# EAGLE design board (EAGLE 9.4.2)
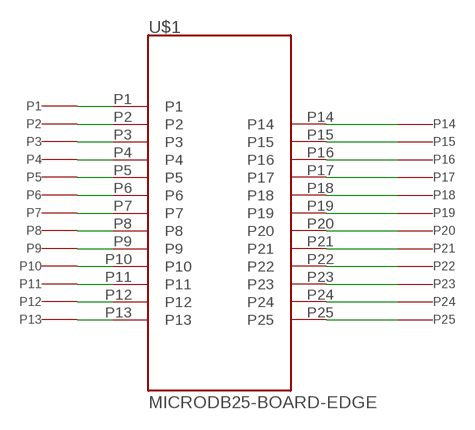
[diagram p0: schematic, sheet 1]

## Parts
P1  TP-19MIL  [TP-19MIL]
P2  TP-19MIL  [TP-19MIL]
P3  TP-19MIL  [TP-19MIL]
P4  TP-19MIL  [TP-19MIL]
P5  TP-19MIL  [TP-19MIL]
P6  TP-19MIL  [TP-19MIL]
P7  TP-19MIL  [TP-19MIL]
P8  TP-19MIL  [TP-19MIL]
P9  TP-19MIL  [TP-19MIL]
P10  TP-19MIL  [TP-19MIL]
P11  TP-19MIL  [TP-19MIL]
P12  TP-19MIL  [TP-19MIL]
P13  TP-19MIL  [TP-19MIL]
P14  TP-19MIL  [TP-19MIL]
P15  TP-19MIL  [TP-19MIL]
P16  TP-19MIL  [TP-19MIL]
P17  TP-19MIL  [TP-19MIL]
P18  TP-19MIL  [TP-19MIL]
P19  TP-19MIL  [TP-19MIL]
P20  TP-19MIL  [TP-19MIL]
P21  TP-19MIL  [TP-19MIL]
P22  TP-19MIL  [TP-19MIL]
P23  TP-19MIL  [TP-19MIL]
P24  TP-19MIL  [TP-19MIL]
P25  TP-19MIL  [TP-19MIL]
U$1  MICRODB25-BOARD-EDGE  [MICRODB25-BOARD-EDGE]

## Nets
N$1: P1.P1 U$1.P1
N$2: P2.P1 U$1.P2
N$3: P3.P1 U$1.P3
N$4: P4.P1 U$1.P4
N$5: P5.P1 U$1.P5
N$6: P6.P1 U$1.P6
N$7: P7.P1 U$1.P7
N$8: P8.P1 U$1.P8
N$9: P9.P1 U$1.P9
N$10: P10.P1 U$1.P10
N$11: P11.P1 U$1.P11
N$12: P12.P1 U$1.P12
N$13: P13.P1 U$1.P13
N$14: P14.P1 U$1.P14
N$15: P15.P1 U$1.P15
N$16: P16.P1 U$1.P16
N$17: P17.P1 U$1.P17
N$18: P18.P1 U$1.P18
N$19: P19.P1 U$1.P19
N$20: P20.P1 U$1.P20
N$21: P21.P1 U$1.P21
N$22: P22.P1 U$1.P22
N$23: P23.P1 U$1.P23
N$24: P24.P1 U$1.P24
N$25: P25.P1 U$1.P25

## Library data of the parts
P1-P25 = RPi-Parts:TP-19MIL
U$1 = RPi-Parts:MICRODB25-BOARD-EDGE

## Board
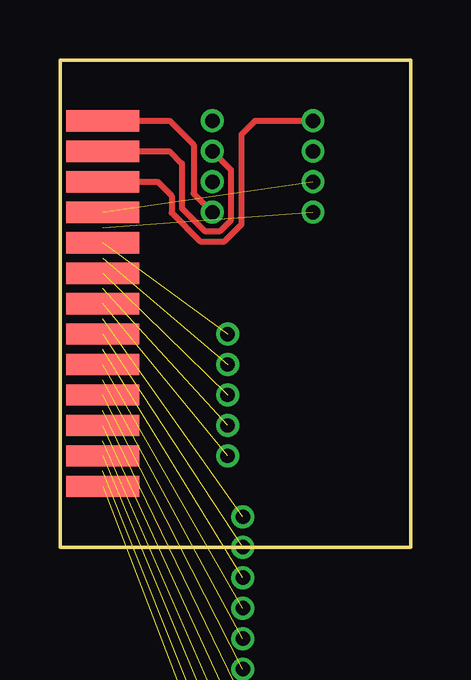
[diagram p1: board, top side]
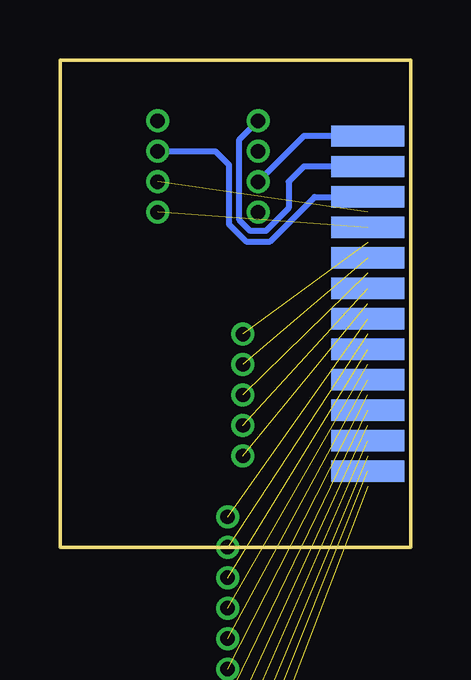
[diagram p2: board, bottom side, seen from below]

Size 14.61 x 20.32 mm. Coordinates in mm from the lower left corner, seen from the top.
Outline: 0,0 0,20.32 14.61,20.32 14.61,0 0,0
Copper layers (1*16): Top 0.035mm / dielectric 1.5mm / Bottom 0.035mm
Design rules "SparkFun-2-layer-TIGHT": minimum track width 7mil, minimum drill 15mil, track to track 7mil, track to pad 7mil, pad to pad 7mil, via to via 7mil, smd to smd 7mil, copper to edge 7mil, drill to drill 7mil, minimum pad ring 7mil, minimum via ring 7mil, stop-mask expansion 4mil, vias tented up to drill 25mil, thermal gap 10mil

### Footprints (pad centres in the part's own frame; a part is rotated, then mirrored left to right if it is on the bottom)
TP-19MIL = drill 0.6 pad 0.838: P1 0,0
MICRODB25-BOARD-EDGE = smd 3.048 x 0.889: P1 0,7.62; P2 0,6.35; P3 0,5.08; P4 0,3.81; P5 0,2.54; P6 0,1.27; P7 0,0; P8 0,-1.27; P9 0,-2.54; P10 0,-3.81; P11 0,-5.08; P12 0,-6.35; P13 0,-7.62 | smd 3.048 x 0.889 bottom: P14 0,6.985; P15 0,5.715; P16 0,4.445; P17 0,3.175; P18 0,1.905; P19 0,0.635; P20 0,-0.635; P21 0,-1.905; P22 0,-3.175; P23 0,-4.445; P24 0,-5.715; P25 0,-6.985

### Placement (x,y rotation side)
P1  6.35,13.97 90 top
P2  6.35,16.51 0 top
P3  10.54,17.78 0 top
P4  10.54,15.24 0 top
P5  6.99,8.89 0 top
P6  6.99,6.35 0 top
P7  6.99,3.81 0 top
P8  7.62,0 180 top
P9  7.62,-2.54 0 top
P10  7.62,-5.08 0 top  (outside the outline)
P11  7.62,-7.62 0 top  (outside the outline)
P12  7.62,-10.16 0 top  (outside the outline)
P13  7.62,-12.7 0 top  (outside the outline)
P14  6.35,15.24 0 top
P15  6.35,17.78 0 top
P16  10.54,16.51 0 top
P17  10.54,13.97 0 top
P18  6.99,7.62 0 top
P19  6.99,5.08 0 top
P20  7.62,1.27 180 top
P21  7.62,-1.27 0 top
P22  7.62,-3.81 0 top  (outside the outline)
P23  7.62,-6.35 0 top  (outside the outline)
P24  7.62,-8.89 0 top  (outside the outline)
P25  7.62,-11.43 0 top  (outside the outline)
U$1  1.78,10.16 0 top

### Tracks (layer width: path | path; a pad name or v marks a point on that pad's centre or on a via)
N$1
  Top 0.254: U$1.P1 4.57,17.78 5.57,16.79 5.57,14.75 P1.P1
N$2
  Top 0.254: U$1.P2 4.57,16.51 5.08,16 5.08,14.13 6.03,13.19 6.67,13.19 7.13,13.65 7.13,15.73 P2.P1
N$3
  Top 0.254: U$1.P3 4.06,15.24 4.65,14.66 4.65,13.95 5.85,12.76 6.85,12.76 7.56,13.47 7.56,17.22 8.13,17.78 P3.P1
N$4  (1 unrouted)
N$5  (1 unrouted)
N$6  (1 unrouted)
N$7  (1 unrouted)
N$8  (1 unrouted)
N$9  (1 unrouted)
N$10  (1 unrouted)
N$11  (1 unrouted)
N$12  (1 unrouted)
N$13  (1 unrouted)
N$14
  Bottom 0.254: U$1.P14 4.45,17.14 P14.P1
N$15
  Bottom 0.254: U$1.P15 4.45,15.88 5.08,15.24 5.08,14.13 6.03,13.19 6.67,13.19 7.13,13.65 7.13,17 P15.P1
N$16
  Bottom 0.254: P16.P1 8.13,16.51 7.56,15.95 7.56,13.47 6.85,12.76 5.85,12.76 4,14.61 U$1.P16
N$17  (1 unrouted)
N$18  (1 unrouted)
N$19  (1 unrouted)
N$20  (1 unrouted)
N$21  (1 unrouted)
N$22  (1 unrouted)
N$23  (1 unrouted)
N$24  (1 unrouted)
N$25  (1 unrouted)